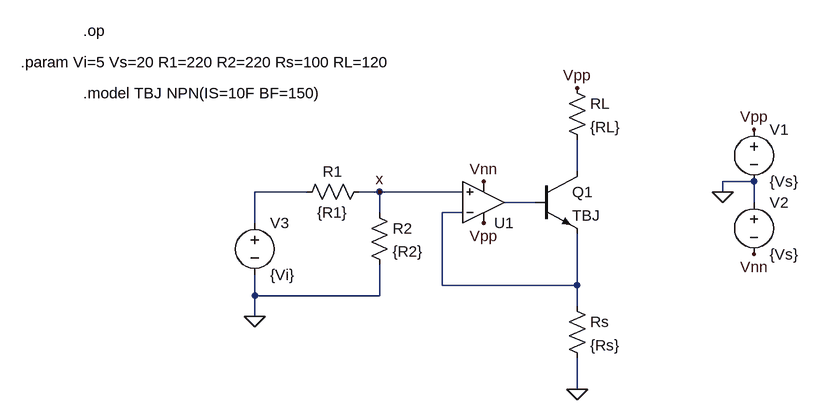
[diagram p0: schematic COMB08op.asc]
COMB08op.asc, the LTspice schematic file:
Version 4
SHEET 1 1720 1076
WIRE 1104 160 1104 112
WIRE 1376 176 1328 176
WIRE 688 192 608 192
WIRE 800 192 768 192
WIRE 928 192 800 192
WIRE 1328 192 1328 176
WIRE 1040 208 992 208
WIRE 1376 208 1376 176
WIRE 800 224 800 192
WIRE 928 224 896 224
WIRE 608 240 608 192
WIRE 896 336 896 224
WIRE 1104 336 1104 256
WIRE 1104 336 896 336
WIRE 608 352 608 320
WIRE 800 352 800 304
WIRE 800 352 608 352
WIRE 1104 368 1104 336
WIRE 608 384 608 352
WIRE 1104 496 1104 448
FLAG 1104 496 0
FLAG 1376 96 Vpp
FLAG 1328 192 0
FLAG 1376 288 Vnn
FLAG 960 240 Vpp
FLAG 960 176 Vnn
FLAG 608 384 0
FLAG 1104 32 Vpp
FLAG 800 192 x
SYMBOL res 784 208 R0
SYMATTR InstName R2
SYMATTR Value {R2}
SYMBOL npn 1040 160 R0
SYMATTR InstName Q1
SYMATTR Value TBJ
SYMBOL res 672 208 R270
WINDOW 0 32 56 VTop 2
WINDOW 3 0 56 VBottom 2
SYMATTR InstName R1
SYMATTR Value {R1}
SYMBOL OpAmps\\UniversalOpAmp2 960 208 M180
SYMATTR InstName U1
SYMBOL voltage 1376 80 R0
WINDOW 123 0 0 Left 0
WINDOW 39 0 0 Left 0
SYMATTR InstName V1
SYMATTR Value {Vs}
SYMBOL voltage 1376 192 R0
WINDOW 123 0 0 Left 0
WINDOW 39 0 0 Left 0
SYMATTR InstName V2
SYMATTR Value {Vs}
SYMBOL voltage 608 224 R0
WINDOW 123 0 0 Left 0
WINDOW 39 0 0 Left 0
SYMATTR InstName V3
SYMATTR Value {Vi}
SYMBOL res 1088 352 R0
SYMATTR InstName Rs
SYMATTR Value {Rs}
SYMBOL res 1088 16 R0
SYMATTR InstName RL
SYMATTR Value {RL}
TEXT 344 -56 Left 2 !.op
TEXT 248 -8 Left 2 !.param Vi=5 Vs=20 R1=220 R2=220 Rs=100 RL=120
TEXT 344 40 Left 2 !.model TBJ NPN(IS=10F BF=150)

The netlist it stands for:
* COMB08op.asc
R2 x 0 {R2}
Q1 N001 N003 N004 0 TBJ
R1 N002 x {R1}
XU1 x N004 Vpp Vnn N003 level2 Avol=1Meg GBW=10Meg Slew=10Meg Ilimit=25m Rail=0 Vos=0 En=0 Enk=0 In=0 Ink=0 Rin=500Meg  ; pins In+ In- V+ V- OUT
V1 Vpp 0 {Vs}
V2 0 Vnn {Vs}
V3 N002 0 {Vi}
Rs N004 0 {Rs}
RL Vpp N001 {RL}
.model NPN NPN
.model PNP PNP
.lib standard.bjt
.op
.param Vi=5 Vs=20 R1=220 R2=220 Rs=100 RL=120
.model TBJ NPN(IS=10F BF=150)
.lib UniversalOpAmp2.lib
.backanno
.end